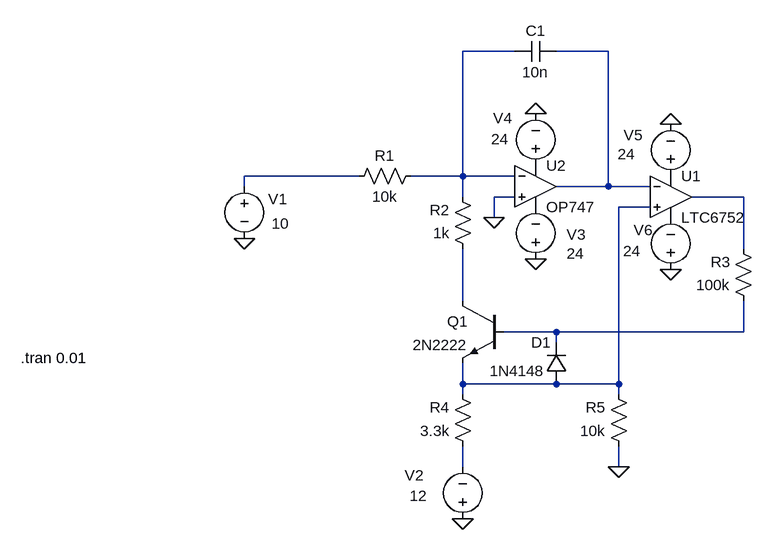
[diagram p0: schematic Draft10.asc]
Draft10.asc, the LTspice schematic file:
Version 4
SHEET 1 880 756
WIRE 160 -16 80 -16
WIRE 304 -16 224 -16
WIRE -80 176 -256 176
WIRE 80 176 80 -16
WIRE 80 176 0 176
WIRE 160 176 80 176
WIRE -256 192 -256 176
WIRE 304 192 304 -16
WIRE 304 192 224 192
WIRE 368 192 304 192
WIRE 80 208 80 176
WIRE 160 208 128 208
WIRE 512 208 432 208
WIRE 368 224 320 224
WIRE 128 240 128 208
WIRE 512 288 512 208
WIRE 80 368 80 288
WIRE 224 416 144 416
WIRE 512 416 512 368
WIRE 512 416 224 416
WIRE 224 432 224 416
WIRE 80 496 80 464
WIRE 224 496 80 496
WIRE 320 496 320 224
WIRE 320 496 224 496
WIRE 80 512 80 496
WIRE 320 512 320 496
WIRE 80 624 80 592
WIRE 320 624 320 592
FLAG 128 240 0
FLAG 320 624 0
FLAG -256 272 0
FLAG 80 704 0
FLAG 192 304 0
FLAG 192 80 0
FLAG 400 96 0
FLAG 400 320 0
SYMBOL cap 224 -32 R90
WINDOW 0 0 32 VBottom 2
WINDOW 3 32 32 VTop 2
SYMATTR InstName C1
SYMATTR Value 10n
SYMBOL res 16 160 R90
WINDOW 0 0 56 VBottom 2
WINDOW 3 32 56 VTop 2
SYMATTR InstName R1
SYMATTR Value 10k
SYMBOL res 96 304 R180
WINDOW 0 36 76 Left 2
WINDOW 3 36 40 Left 2
SYMATTR InstName R2
SYMATTR Value 1k
SYMBOL res 528 384 R180
WINDOW 0 36 76 Left 2
WINDOW 3 36 40 Left 2
SYMATTR InstName R3
SYMATTR Value 100k
SYMBOL res 96 608 R180
WINDOW 0 36 76 Left 2
WINDOW 3 36 40 Left 2
SYMATTR InstName R4
SYMATTR Value 3.3k
SYMBOL res 336 608 R180
WINDOW 0 36 76 Left 2
WINDOW 3 36 40 Left 2
SYMATTR InstName R5
SYMATTR Value 10k
SYMBOL npn 144 368 M0
SYMATTR InstName Q1
SYMATTR Value 2N2222
SYMBOL diode 240 496 R180
WINDOW 0 24 64 Left 2
WINDOW 3 34 20 Left 2
SYMATTR InstName D1
SYMATTR Value 1N4148
SYMBOL voltage -256 176 R0
WINDOW 0 37 35 Left 2
WINDOW 3 42 73 Left 2
WINDOW 123 -122 201 Left 2
WINDOW 39 0 0 Left 0
SYMATTR InstName V1
SYMATTR Value 10
SYMBOL voltage 80 720 R180
WINDOW 0 60 83 Left 2
WINDOW 3 55 52 Left 2
SYMATTR InstName V2
SYMATTR Value 12
SYMBOL voltage 192 320 R180
WINDOW 0 -77 54 Left 2
WINDOW 3 -75 25 Left 2
SYMATTR InstName V3
SYMATTR Value 24
SYMBOL voltage 192 176 R180
WINDOW 0 36 89 Left 2
WINDOW 3 41 57 Left 2
SYMATTR InstName V4
SYMATTR Value 24
SYMBOL voltage 400 192 R180
WINDOW 0 43 79 Left 2
WINDOW 3 55 50 Left 2
SYMATTR InstName V5
SYMATTR Value 24
SYMBOL voltage 400 336 R180
WINDOW 0 28 77 Left 2
WINDOW 3 46 45 Left 2
SYMATTR InstName V6
SYMATTR Value 24
SYMBOL Comparators\\LTC6752 400 144 R0
SYMATTR InstName U1
SYMBOL OpAmps\\OP747 192 128 R0
SYMATTR InstName U2
TEXT -600 456 Left 2 !.tran 0.01

The netlist it stands for:
* Draft10.asc
C1 N002 N001 10n
R1 N001 N003 10k
R2 N006 N001 1k
R3 N007 N004 100k
R4 N008 N005 3.3k
R5 0 N005 10k
Q1 N006 N007 N005 0 2N2222
D1 N005 N007 1N4148
V1 N003 0 10
V2 0 N008 12
V3 0 P001 24
V4 P002 0 24
V5 P003 0 24
V6 0 P004 24
XU1 N005 N002 P003 P004 N004 LTC6752  ; pins In+ In- V+ V- OUT
XU2 0 N001 P002 P001 N002 OP747  ; pins In+ In- V+ V- OUT
.model D D
.lib standard.dio
.model NPN NPN
.model PNP PNP
.lib standard.bjt
.tran 0.01
.lib LTC7.lib
.backanno
.end